# EAGLE design servoSchematic (EAGLE 9.2.0)
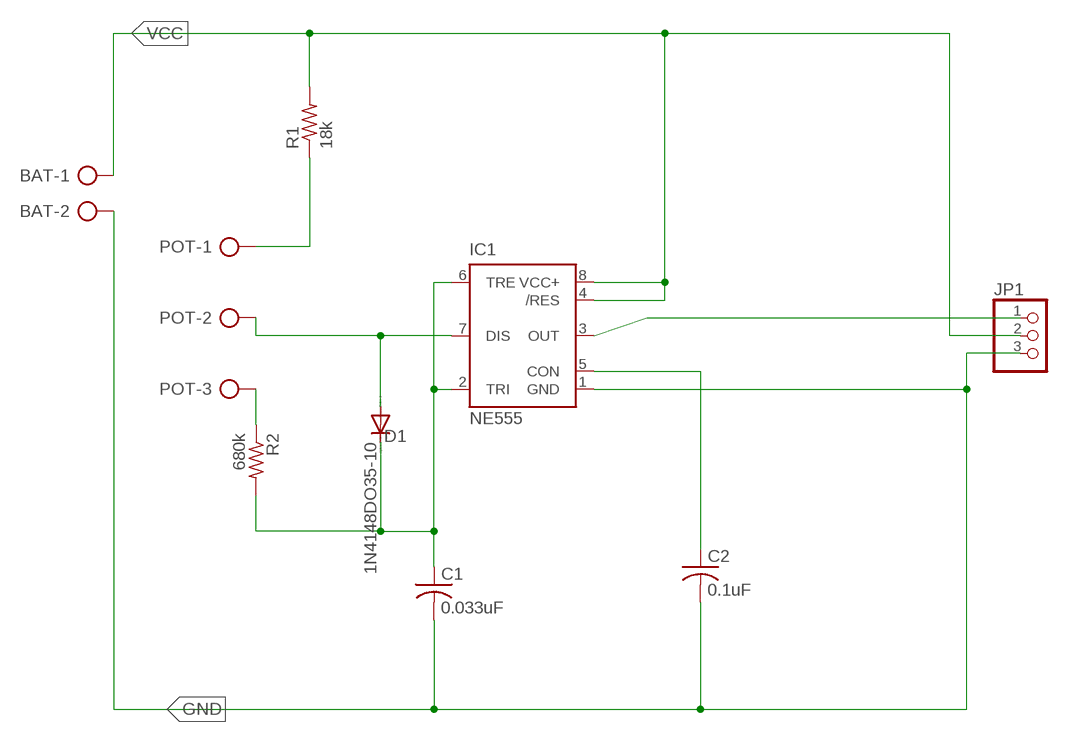
[diagram p0: schematic, sheet 1]

## Parts
BAT  AK500/2  [AK500/2]
C1  0.033uF  C-US025-024X044  [C025-024X044]
C2  0.1uF  C-US025-024X044  [C025-024X044]
D1  1N4148DO35-10  [DO35-10]
IC1  NE555  [DIL-08]
JP1  PINHD-1X3/90  [1X03/90]
POT  AK500/3  [AK500/3]
R1  18k  R-US_0204/7  [0204/7]
R2  680k  R-US_0204/7  [0204/7]

## Nets
GND: BAT.2 C1.2 C2.2 IC1.1(GND) JP1.3
N$3: POT.1 R1.1
N$4: C1.1 D1.C IC1.2(TRI) IC1.6(TRE) R2.2
N$5: D1.A IC1.7(DIS) POT.2
N$6: POT.3 R2.1
N$7: IC1.3(OUT) JP1.1
N$8: C2.1 IC1.5(CON)
VCC [VCC]: BAT.1 IC1.4(/RES) IC1.8(VCC+) JP1.2 R1.2

## Library data of the parts
BAT = con-ptr500:AK500/2: CONNECTOR; OC_FARNELL: unknown; OC_NEWARK: unknown
C1 C2 = rcl:C-US: CAPACITOR, American symbol; SPICEPREFIX: C
D1 = diode:1N4148: DIODE high speed (Philips)
IC1 = st-microelectronics:NE555: General purpose bipolar Timer; MF: Arrow Electronics; MPN: NE555N; OC_FARNELL: 1467742; OC_NEWARK: 89K1486
JP1 = pinhead:PINHD-1X3: PIN HEADER
POT = con-ptr500:AK500/3: CONNECTOR; OC_FARNELL: unknown; OC_NEWARK: unknown
R1 R2 = rcl:R-US_: RESISTOR, American symbol; SPICEPREFIX: R

## Net classes
0 NET: width 0.4 mm
1 VCC: width 0.8 mm

## Board
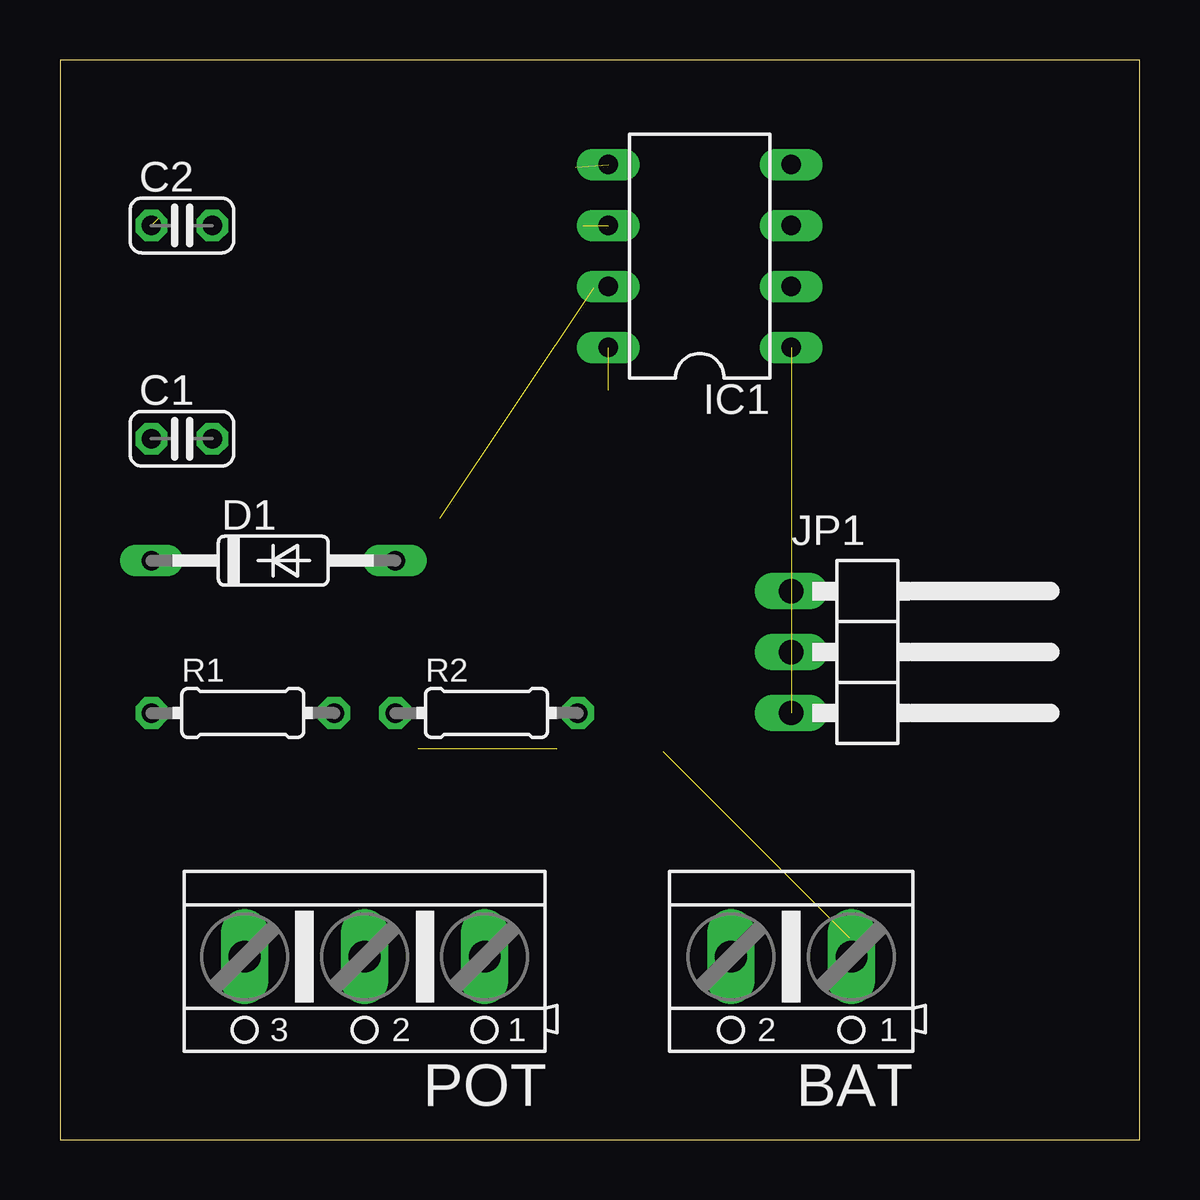
[diagram p1: board, top side]
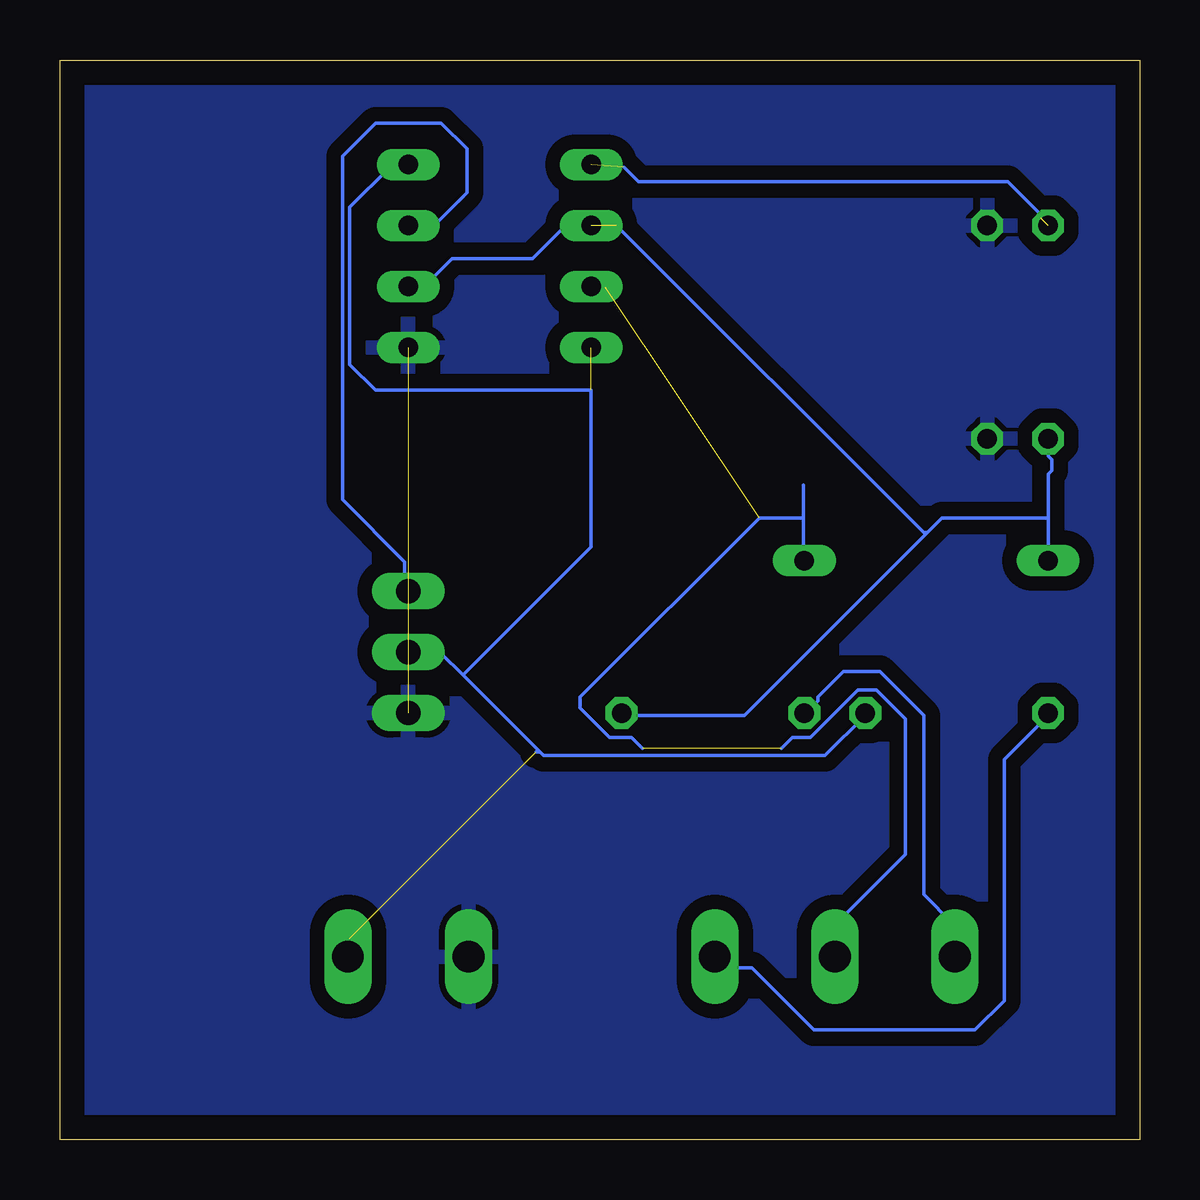
[diagram p2: board, bottom side, seen from below]

Size 45 x 45 mm. Coordinates in mm from the lower left corner, seen from the top.
Outline: 0,0 45,0 45,45 0,45 0,0
Copper layers (1*16): Top 0.035mm / dielectric 1.5mm / Bottom 0.035mm
Design rules "default": minimum track width 6mil, minimum drill 0.35mm, track to track 6mil, track to pad 6mil, pad to pad 6mil, via to via 6mil, smd to smd 6mil, copper to edge 40mil, drill to drill 6mil, minimum pad ring 10mil, minimum via ring 8mil, stop-mask expansion 4mil, vias tented up to drill 0mil, thermal gap 10mil

### Footprints (pad centres in the part's own frame; a part is rotated, then mirrored left to right if it is on the bottom)
AK500/2 = drill 1.321 long: 1 -2.515,0; 2 2.515,0
C025-024X044 = drill 0.813 octagon: 1 -1.27,0; 2 1.27,0
DO35-10 = drill 0.813 long: A 5.08,0; C -5.08,0
DIL-08 = drill 0.813 long: 1 -3.81,-3.81; 2 -1.27,-3.81; 3 1.27,-3.81; 4 3.81,-3.81; 5 3.81,3.81; 6 1.27,3.81; 7 -1.27,3.81; 8 -3.81,3.81
1X03/90 = drill 1.016 long: 1 -2.54,-3.81; 2 0,-3.81; 3 2.54,-3.81
AK500/3 = drill 1.321 long: 1 -5.004,0; 2 0,0; 3 5.004,0
0204/7 = drill 0.813 octagon: 1 -3.81,0; 2 3.81,0

### Placement (x,y rotation side)
BAT  30.48,7.62 180 top
C1  5.08,29.21 0 top
C2  5.08,38.1 0 top
D1  8.89,24.13 0 top
IC1  26.67,36.83 90 top
JP1  34.29,20.32 270 top
POT  12.7,7.62 180 top
R1  7.62,17.78 0 top
R2  17.78,17.78 0 top

### Tracks (layer width: path | path; a pad name or v marks a point on that pad's centre or on a via)
GND  (1 unrouted)
  pour Bottom (isolate 0.6): -6.35,-6.35 49.53,-6.35 49.53,50.8 -8.89,50.8 -8.89,-6.35
N$3
  Bottom 0.152: R1.1 3.81,17.68 5.64,15.85 5.64,5.79 6.86,4.57 13.56,4.57 16.15,7.16 17.22,7.16 17.68,7.62 POT.1
N$4  (1 unrouted)
  Bottom 0.152: IC1.6 23.93,38.1 25.3,36.73 28.65,36.73 29.72,35.66 30.48,35.66 IC1.2 | 3.81,25.91 3.81,27.74 3.66,27.89 3.66,28.35 3.81,28.5 C1.1 | 3.81,25.91 D1.C | 8.84,25.3 8.23,25.91 3.81,25.91 | 8.84,25.3 16.46,17.68 21.49,17.68 R2.2 | 21.79,38.1 8.99,25.3 8.84,25.3
N$5  (2 unrouted)
  Bottom 0.152: 14.02,27.28 14.02,25.91 | 14.02,25.91 14.02,24.23 D1.A | 22.25,35.51 22.86,35.51 IC1.7 | 14.94,16.31 14.48,16.76 13.72,16.76 11.73,18.75 10.97,18.75 9.75,17.53 9.75,11.89 12.65,8.99 12.65,7.62 POT.2 | 20.73,16.31 21.18,16.76 22.1,16.76 23.32,17.98 23.32,18.44 15.85,25.91 14.02,25.91
N$6
  Bottom 0.152: R2.1 13.87,17.83 13.41,18.29 13.41,18.44 12.34,19.51 10.82,19.51 8.99,17.68 8.99,10.21 7.77,8.99 7.77,7.62 POT.3
N$7
  Bottom 0.152: IC1.3 29.41,38.1 28.04,39.47 28.04,41.3 29.11,42.37 31.85,42.37 33.22,41 33.22,26.67 30.63,24.08 30.63,23.01 JP1.1
N$8  (2 unrouted)
  Bottom 0.152: 4.12,38.41 4.12,38.56 5.49,39.93 20.88,39.93 21.49,40.54
VCC  (2 unrouted)
  Bottom 0.152: 28.19,19.36 29.11,20.27 30.48,20.27 JP1.2 | 28.19,19.36 24.99,16.15 | 24.99,16.15 24.84,16 13.11,16 11.43,17.68 R1.2 | 28.19,19.36 22.86,24.69 22.86,31.24 31.85,31.24 32.92,32.31 32.92,38.86 31.24,40.54 30.48,40.54 IC1.4 | 32.92,8.38 32.92,7.62 BAT.1 | 24.99,16.15 25.15,16.15